# Altium project VSS-Hardware-2026.PrjPcb
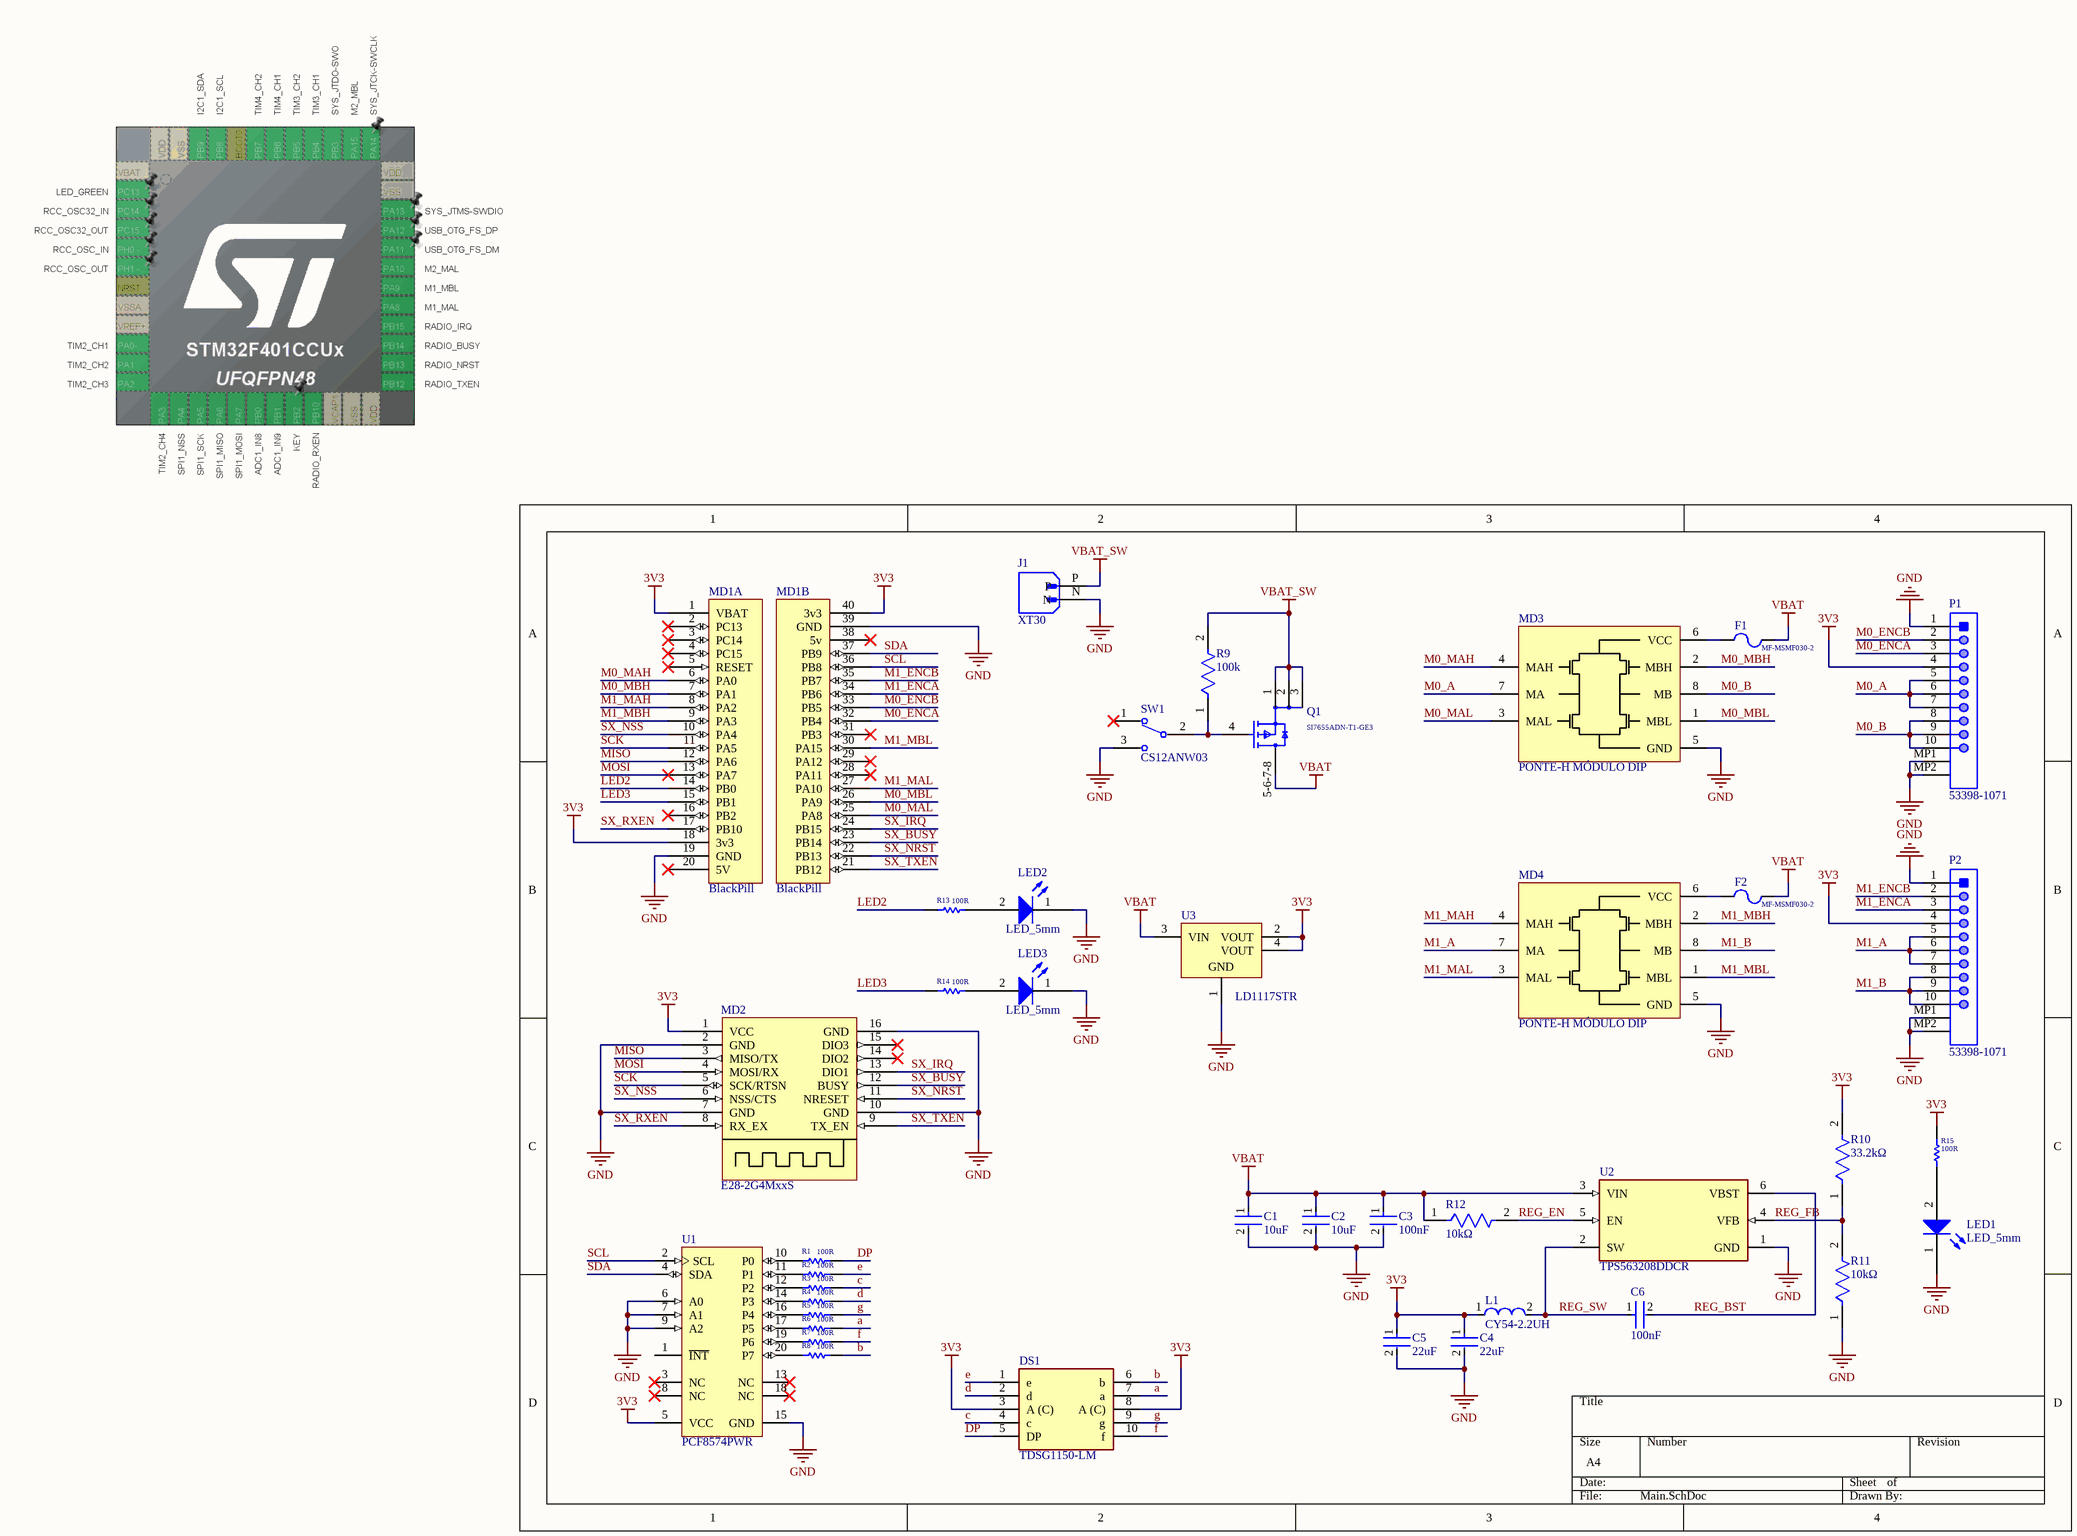
[diagram p0: Main.SchDoc]
1 sheet, 40 parts. Net scope: global (net labels, ports and power ports of the same name join across sheets).
Board file: VSS-2026.PcbDoc

## Sheet Main.SchDoc
size A4; SheetNumber: 1; SheetTotal: 1

### Parts
C1  10uF  [FP-CL21-IPC_C]
C2  10uF  [FP-CL21-IPC_C]
C3  100nF  [FP-CL21-IPC_C]
C4  22uF  [FP-CL21-IPC_C]
C5  22uF  [FP-CL21-IPC_C]
C6  100nF  [FP-CL21-IPC_C]
DS1  TDSG1150-LM  [TDSG1150LM]
F1  MF-MSMF030-2  [BOUR-MF-MSMF030-2_V]
F2  MF-MSMF030-2  [BOUR-MF-MSMF030-2_V]
J1  XT30  [XT30]
L1  CY54-2.2UH  [INDP5852X48N]
LED1  LED_5mm  [LED_5mm]
LED2  LED_5mm  [LED_5mm]
LED3  LED_5mm  [LED_5mm]
MD1  BlackPill  [BlackPill]  (parts A,B of 2)
MD2  E28-2G4MxxS  [E28-2G4M12S]
MD3  PONTE-H MÓDULO DIP  [PONTEH-PCB]
MD4  PONTE-H MÓDULO DIP  [PONTEH-PCB]
P1  53398-1071  [MOLX-53398-1071_V]
P2  53398-1071  [MOLX-53398-1071_V]
Q1  SI7655ADN-T1-GE3  [FP-C20-0862-SINGLE-MFG]
R1  100R  [RESC2013X50X30LL20T20]
R2  100R  [RESC2013X50X30LL20T20]
R3  100R  [RESC2013X50X30LL20T20]
R4  100R  [RESC2013X50X30LL20T20]
R5  100R  [RESC2013X50X30LL20T20]
R6  100R  [RESC2013X50X30LL20T20]
R7  100R  [RESC2013X50X30LL20T20]
R8  100R  [RESC2013X50X30LL20T20]
R9  100k  [FP-CRCW0805-e3-IPC_C]
R10  33.2kΩ  [FP-CRCW0805-e3-IPC_C]
R11  10kΩ  [FP-CRCW0805-e3-IPC_C]
R12  10kΩ  [FP-CRCW0805-e3-IPC_C]
R13  100R  [RESC2013X50X30LL20T20]
R14  100R  [RESC2013X50X30LL20T20]
R15  100R  [RESC2013X50X30LL20T20]
SW1  CS12ANW03  [FP-CS12ANW03-MFG]
U1  PCF8574PWR  [PW0020A_L]
U2  TPS563208DDCR  [FP-DDC0006A-MFG]
U3  LD1117STR  [SOT-223_L]

### Nets
3V3: C4.1 C5.1 DS1.3(A_(C)) DS1.8(A_(C)) L1.1 MD1.1(VBAT) MD1.18(3v3) MD1.40(3v3) MD2.1(VCC) P1.4 P2.4 R10.2 R15.2 U1.5(VCC) U3.2(VOUT) U3.4(VOUT)
GND: C1.2 C2.2 C3.2 C4.2 C5.2 J1.N LED1.1(K) LED2.1(K) LED3.1(K) MD1.19(GND) MD1.39(GND) MD2.2(GND) MD2.7(GND) MD2.10(GND) MD2.16(GND) MD3.5(GND) MD4.5(GND) P1.1 P1.MP1 P1.MP2 P2.1 P2.MP1 P2.MP2 R11.1 SW1.3 U1.6(A0) U1.7(A1) U1.9(A2) U1.15(GND) U2.1(GND) U3.1(GND)
VBAT: C1.1 C2.1 C3.1 F1.2 F2.2 Q1.5-6-7-8(D) R12.1 U2.3(VIN) U3.3(VIN)
VBAT_SW: J1.P Q1.1(S) Q1.2(S) Q1.3(S) R9.2
a: DS1.7(a) R6.2
b: DS1.6(b) R8.2
c: DS1.4(c) R3.2
d: DS1.2(d) R4.2
DP: DS1.5(DP) R1.2
e: DS1.1(e) R2.2
f: DS1.10(f) R7.2
g: DS1.9(g) R5.2
LED2: MD1.14(PB0) R13.1
LED3: MD1.15(PB1) R14.1
M0_A: MD3.7(MA) P1.5 P1.6 P1.7
M0_B: MD3.8(MB) P1.8 P1.9 P1.10
M0_ENCA: MD1.32(PB4) P1.3
M0_ENCB: MD1.33(PB5) P1.2
M0_MAH: MD1.6(PA0) MD3.4(MAH)
M0_MAL: MD1.25(PA8) MD3.3(MAL)
M0_MBH: MD1.7(PA1) MD3.2(MBH)
M0_MBL: MD1.26(PA9) MD3.1(MBL)
M1_A: MD4.7(MA) P2.5 P2.6 P2.7
M1_B: MD4.8(MB) P2.8 P2.9 P2.10
M1_ENCA: MD1.34(PB6) P2.3
M1_ENCB: MD1.35(PB7) P2.2
M1_MAH: MD1.8(PA2) MD4.4(MAH)
M1_MAL: MD1.27(PA10) MD4.3(MAL)
M1_MBH: MD1.9(PA3) MD4.2(MBH)
M1_MBL: MD1.30(PA15) MD4.1(MBL)
MISO: MD1.12(PA6) MD2.3(MISO/TX)
MOSI: MD1.13(PA7) MD2.4(MOSI/RX)
REG_BST: C6.2 U2.6(VBST)
REG_EN: R12.2 U2.5(EN)
REG_FB: R10.1 R11.2 U2.4(VFB)
REG_SW: C6.1 L1.2 U2.2(SW)
SCK: MD1.11(PA5) MD2.5(SCK/RTSN)
SCL: MD1.36(PB8) U1.2(SCL)
SDA: MD1.37(PB9) U1.4(SDA)
SX_BUSY: MD1.23(PB14) MD2.12(BUSY)
SX_IRQ: MD1.24(PB15) MD2.13(DIO1)
SX_NRST: MD1.22(PB13) MD2.11(NRESET)
SX_NSS: MD1.10(PA4) MD2.6(NSS/CTS)
SX_RXEN: MD1.17(PB10) MD2.8(RX_EX)
SX_TXEN: MD1.21(PB12) MD2.9(TX_EN)
NetF1_1: F1.1 MD3.6(VCC)
NetF2_1: F2.1 MD4.6(VCC)
NetLED1_2: LED1.2(A) R15.1
NetLED2_2: LED2.2(A) R13.2
NetLED3_2: LED3.2(A) R14.2
NetQ1_4: Q1.4(G) R9.1 SW1.2(2(COM))
NetR1_1: R1.1 U1.10(P0)
NetR2_1: R2.1 U1.11(P1)
NetR3_1: R3.1 U1.12(P2)
NetR4_1: R4.1 U1.14(P3)
NetR5_1: R5.1 U1.16(P4)
NetR6_1: R6.1 U1.17(P5)
NetR7_1: R7.1 U1.19(P6)
NetR8_1: R8.1 U1.20(P7)

Not connected (* = marked no-connect by the designer): MD1 2(PC13)* 3(PC14)* 4(PC15)* 5(RESET)* 16(PB2)* 20(5V)* 28(PA11)* 29(PA12)* 31(PB3)* 38(5v)*; MD2 14(DIO2)* 15(DIO3)*; SW1 1*; U1 1(~{INT}) 3(NC)* 8(NC)* 13(NC)* 18(NC)*

### Library data of the parts
C1 C2 = CMP-13271-002240-1: CL21 Series 0805 10uF 16V ±10% Tolerance X5R Multilayer Ceramic Chip Capacitor; Capacitance: 10uF; Case Code (Metric): 2012; Package Quantity: 3000; Width: 0.049inch; Mount: Surface Mount; Depth: 1.25mm; Material: Ceramic; Min Operating Temperature: -55°C; Thickness: 0.053inch; Tolerance: 10%; Case Code (Imperial): 0805; Packaging: Tape and Reel; Voltage Rating: 16V; Case/Package: 0805; Height: 1.25mm; Voltage: 16V; Max Operating Temperature: 85°C; Length: 2mm; Dielectric: X5R
C3 C6 = CMP-13271-002854-1: CL21 Series 0805 100nF 25V ±10% Tolerance X7R Multilayer Ceramic Chip Capacitor; Thickness: 0.037inch; Dielectric: X7R; Packaging: Tape and Reel; Height: 0.85mm; Case/Package: 0805; Mount: Surface Mount; Case Code (Imperial): 0805; Capacitance: 100nF; Case Code (Metric): 2012; Length: 2mm; Voltage Rating: 25V; Voltage: 25V; Contact Plating: Tin; Tolerance: 10%; Max Operating Temperature: 125°C; Width: 0.049inch; Min Operating Temperature: -55°C; Radiation Hardening: No; Package Quantity: 1; Depth: 1.25mm
C4 C5 = CMP-13271-003225-1: CL21 Series 0805 22uF 25V ±20% Tolerance X5R Multilayer Ceramic Chip Capacitor
DS1 = TDSG1150-LM: LED Displays & Accessories 7-Seg Green 7 mm Common anode; Manufacturer_Name: Vishay; Geometry.Height: 7.2mm; Mouser Part Number: 78-TDSG1150-LM; Mouser Price/Stock: https://www.mouser.co.uk/ProductDetail/Vishay-Semiconductors/TDSG1150-LM?qs=1F7whG1WZO07bTxUDRW5PQ%3D%3D; Manufacturer_Part_Number: TDSG1150-LM; Datasheet Link: http://www.vishay.com/docs/83124/tdsg11.pdf
F1 F2 = CMP-2000-06692-1: MF-MSMF Series - PTC Resettable Fuse, 30 V, -40 to 85 degC, 2-Pin SMD (1812), RoHS, Tape and Reel; Manufacturer: Bourns; Holding Current: 300mA; Operating Voltage: 30V; Initial Resistance Max: 3ohm; Tripping Current: 600mA; Carrying Current Max: 10A; Current Rating: 10000mA; Tripped Power Dissipation: 800mW; PTC Fuse Case: 1812^4532Metric]; SVHC: NoSVHC(20-Jun-2013); Package Reference: MF-MSMF030-2; Voltage Rating: 30V; Manufacturer URL: http://www.bourns.com/; Datasheet Version: Rev. O, 08/2006; Package Description: 2-Pin SMD, Body 4.55 x 3.24 mm; Datasheet URL: https://datasheet.ciiva.com/19479/1164197-19479043.pdf; Series: MF-MSMF; PartNumber: MF-MSMF; Mounting Technology: SurfaceMount
J1 = XT30: Socket; DC supply; XT30; male; PIN: 2; on PCBs; THT; Colour: yellow; MF: AMASS; MP: XT30PW-M; Package: None; Price: None; Value: *; SnapEDA_Link: https://www.snapeda.com/parts/XT30PW-M/AMASS/view-part/?ref=snap; Availability: Not in stock; Check_prices: https://www.snapeda.com/parts/XT30PW-M/AMASS/view-part/?ref=eda
L1 = CY54-2.2UH: 4A 2.2uH ±20% 22.1mΩ SMD,5.8x5.2mm Inductors (SMD) ROHS
LED1-LED3 = LED_5mm: LED 5mm generic
MD1 = BlackPill: STM32F4x1CxU6 BlackPill
MD2 = E28-2G4MxxS: E28-2G4MxxS Ebyte SX1280 Module
MD3 MD4 = PONTEH-2016: MÓDULO PONTE H DIP ROBOIME
P1 P2 = CMP-2000-05635-1: Male Header, Pitch 1.25 mm, 1 x 10 Position, Height 4.7 mm, -40 to 85 degC, RoHS, Tape and Reel; Manufacturer: Molex; Mounting Angle: Vertical; Pitch: 1.25mm; Voltage Rating: 125V; Current Rating: 1A; Number of Rows: 1Row; Housing Material: Nylon; Mounting Technology: SurfaceMount; Mounting Style: SMD; Contact Material: PhosphorBronze; Product: Headers; Datasheet URL: http://www.molex.com/pdm_docs/sd/533981071_sd.pdf; Manufacturer URL: http://www.molex.com/; Datasheet Version: Rev. J, 09/2015; Factory Pack Quantity: 1000; Brand: Molex; Packaging: Reel; Product Category: Headers&WireHousings; Contact Gender: Pin(Male); Number of Positions: 10Position; RoHS: Details; Contact Plating: Tin; Package Description: Male Header, Pitch 1.25 mm, 1 x 10 Position, Height 4.7 mm; Series: 53398; Type: Shrouded; Package Reference: 53398-1071; Tradename: PicoBlade; Termination Style: SMD
Q1 = CMP-00030-31553184-1: SI7655ADN-T1-GE3 20V 40A 3.6m´Î@10V20A 57W 1.1V@250Ã×A P Channel PowerPAK 1212-8S MOSFETs ROHS; Continuous Drain Current (ID): -40A; Turn-Off Delay Time: 100ns; Drain to Source Breakdown Voltage: -20V; Input Capacitance: 6.6nF; Turn-On Delay Time: 45ns; Rds On Max: 3.6mΩ; Number of Channels: 1; Resistance: 3mΩ; Fall Time: 35ns; Gate to Source Voltage (Vgs): 12V; REACH SVHC: No SVHC; Schedule B: 8541290080, 8541290080; NexarPartId: 31553184; Mount: Surface Mount; Drain to Source Voltage (Vdss): 20V; RoHS: Compliant; Max Operating Temperature: 150°C; Drain to Source Resistance: 3.6mΩ; Rise Time: 45ns; Max Power Dissipation: 57W; Number of Pins: 8; Min Operating Temperature: -50°C
R1-R8 R13-R15 = CMP-2001-04901-1: Manufacturer: Vishay Dale; Part Number: CRCW0805100RFKEA
R9 = CMP-2001-04899-2: RES Thick Film, 100kΩ, 1%, 0.125W, 100ppm/°C, 0805; Resistance: 100kR; Power Rating: 125mW; Voltage Rating: 150V; Case/Package: 0805; Max Operating Temperature: 155°C; Case Code (Imperial): 0805; Lead Free: Lead Free; Weight: 0.000194oz; Number of Pins: 2; Package Quantity: 5000; Height: 0.45mm; Composition: Thick Film; Military Standard: Not; Tolerance: 1%; Case Code (Metric): 2012; Termination: SMD/SMT; Mount: Surface Mount; Radiation Hardening: No; Width: 1.25mm; Length: 2mm; Depth: 1.25mm; Packaging: Tape and Reel; Min Operating Temperature: -55°C; Contact Plating: Tin; Temperature Coefficient: 100ppm/°C; Voltage Rating (DC): 150V
R10 = CMP-2001-03829-2: RES Thick Film, 33.2kΩ, 1%, 0.125W, 100ppm/°C, 0805; Power Rating: 125mW; Voltage Rating: 150V; Resistance: 33.2kR; Termination: SMD/SMT; Temperature Coefficient: 100ppm/°C; Contact Plating: Tin; Case/Package: 0805; Lead Free: Lead Free; Package Quantity: 10; Tolerance: 1%; Length: 2mm; Composition: Thick Film; Military Standard: Not; Max Operating Temperature: 155°C; Depth: 1.25mm; Case Code (Imperial): 0805; Packaging: Tape and Reel; Number of Terminations: 2; Voltage Rating (DC): 150V; Radiation Hardening: No; Weight: 0.000194oz; Min Operating Temperature: -55°C; Max Power Dissipation: 125mW; Case Code (Metric): 2012; Features: Automotive AEC-Q200; Height: 0.45mm; Width: 0.049inch
R11 R12 = CMP-2001-04908-2: RES Thick Film, 10kΩ, 1%, 0.125W, 100ppm/°C, 0805; Resistance: 10kR; Voltage Rating (DC): 150V; Power Rating: 125mW; Weight: 0.000194oz; Package Quantity: 5000; Military Standard: Not; Max Operating Temperature: 155°C; Temperature Coefficient: 100ppm/°C; Contact Plating: Tin; Width: 1.25mm; Height: 0.45mm; Radiation Hardening: No; Tolerance: 1%; Min Operating Temperature: -55°C; Voltage Rating: 150V; Length: 2mm; Depth: 1.25mm; Termination: SMD/SMT; Packaging: Tape and Reel; Case/Package: 0805; Case Code (Metric): 2012; Lead Free: Lead Free; Case Code (Imperial): 0805; Composition: Thick Film
SW1 = CMP-31746-000002-1: SWITCH SLIDE SPDT 3A 125V; Max Voltage Rating (AC): 250V; Mechanical Life: 50000Cycles; Switch Travel: 2.2mm; Electrical Life: 20000Cycles; Actuator Length: 5.1mm; Illumination Type: Non-Illuminated; Contact Style: Non-Shorting; Actuator Type: Standard; Actuator Material: Nylon; Switch Function: On-On; Max Operating Temperature: 85°C; Series: CS; Contact Current Rating: 3A; Min Operating Temperature: -30°C; Current Rating: 3A; Mount: Through Hole; Depth: 7.5mm; RoHS Compliant: Yes; Throw Configuration: SPDT; Lead Free: Lead Free; Orientation: Vertical; Contact Plating: Silver; Reach SVHC Compliant: Yes; Termination: PC Pin; Max Current Rating: 3A; Packaging: Tray; Length: 14mm; Package Quantity: 1; Primary Type: SWITCH; Flammability Rating: UL94 V-0; Contact Material: Copper; Voltage Rating (AC): 125V
U1 = CMP-0314-00348-2: Remote 8-Bit I/O Expander for I2C-Bus, 2.5 to 6 V, -40 to 85 degC, 20-pin TSSOP (PW), Green (RoHS & no Sb/Br); Manufacturer: Texas Instruments; Push-Pull I/O Type: Yes; Max Frequency(kHz): 100; SubFamily: I2C IO Expander; Voltage Nodes(V): 5, 3.3; # of I/Os: 8; VCC(Min)(V): 2.5; VCC(Max)(V): 6; I2C Address: 0100 xxx; Vcc range(V): 2.5 to 6.0; fSCLK(Max)(MHz): 0.1; PartNumber: PCF8574PWR; Mounting Technology: Surface Mount; Eco-Plan: Green (RoHS & no Sb/Br); PackageDescription: 20-Pin Plastic Thin Small Outline Package 6.5 x 4.4 mm Body ,0.65 mm Pitch; PackageVersion: revG, Feb-2011; ComponentLink1Description: Datasheet; Reset Input: No; ComponentLink1URL: http://www.ti.com/general/docs/lit/getliterature.tsp?genericPartNumber=PCF8574&fileType=pdf; PackageReference: PW0020A; Code_JEDEC: MO-153; DatasheetVersion: SCPS068G; Interrupt Output: Yes
U2 = CMP-04918-000356-1: IC REG BUCK ADJ 3A TSOT23-6; Min Output Voltage: 768mV; Output Configuration: Positive; Max Output Voltage: 7V; Quiescent Current: 400uA; Max Input Voltage: 17V; Min Input Voltage: 4.5V; Synchronous Rectifier: Yes; Switching Frequency: 580kHz; Number of Outputs: 1; Output Type: Adjustable; Mount: Surface Mount; Case/Package: SOT-23-6; Min Operating Temperature: -40°C; Packaging: Tape and Reel; RoHS Compliant: Yes; Output Current: 3A; Lead Free: Lead Free; Max Operating Temperature: 125°C
U3 = CMP-0244-00313-1: Adjustable Low Drop Voltage Regulator, 1.25 to 15V, 4-Pin SOT-223, Tape and Reel; ComponentLink2Description: Datasheet; PackageVersion: 2010; PackageReference: SOT-223; ComponentLink2URL: http://www.st.com/internet/com/TECHNICAL_RESOURCES/TECHNICAL_LITERATURE/DATASHEET/CD00000544.pdf; DatasheetVersion: 1/11/2011; ComponentLink1URL: http://www.st.com; PackageDescription: 4-Pin SOT-223 Package, 6.5 x 3.5 mm Body, 2.3 mm Pitch, 7 mm Lead Span; ComponentLink1Description: Manufacturer URL